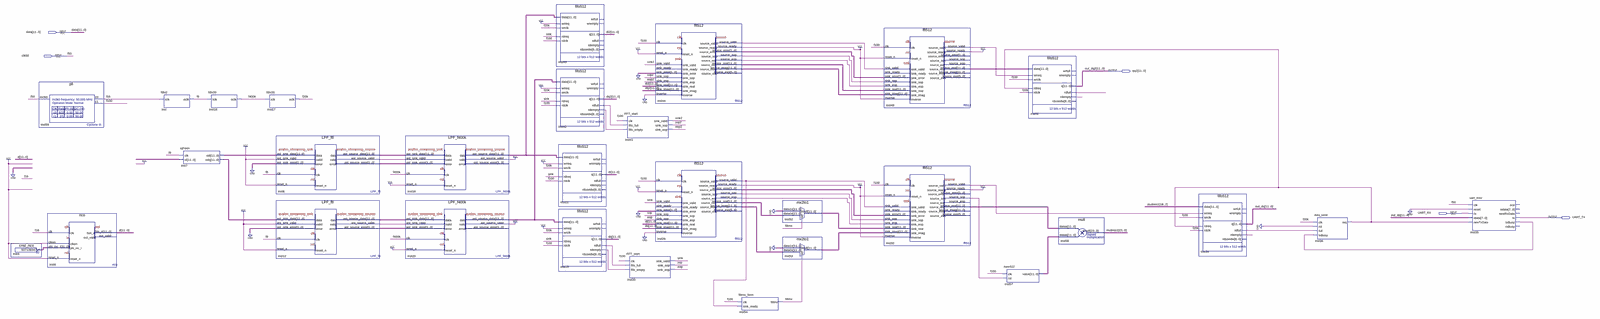
[diagram p0: schematic sheet, whole]
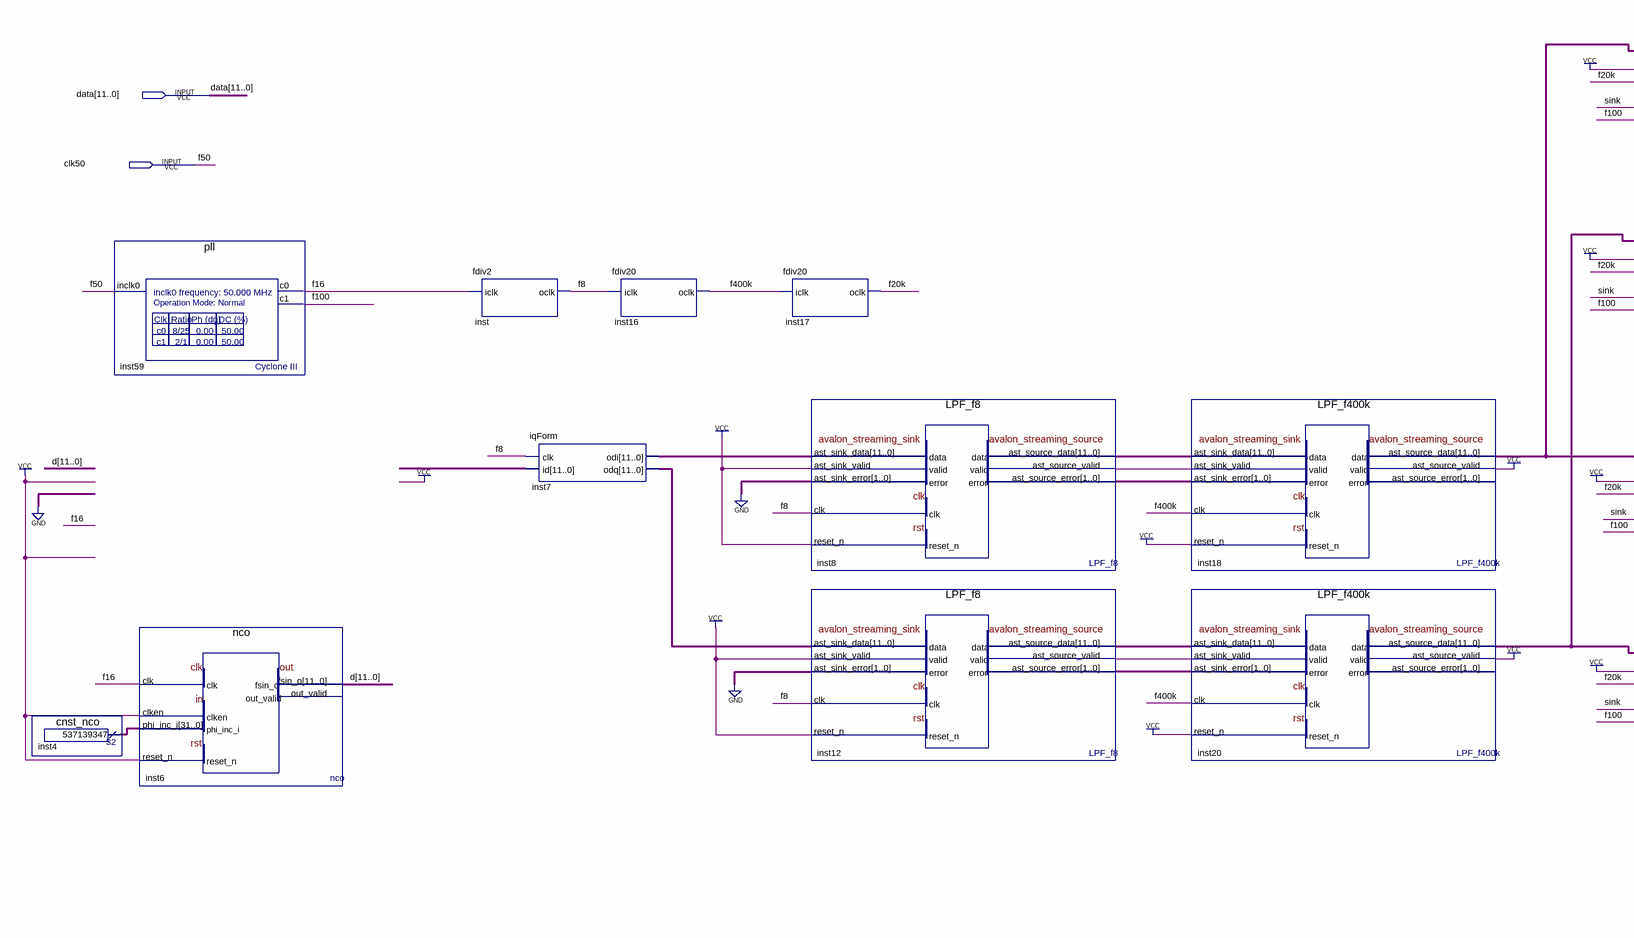
[diagram p1: schematic sheet, left part]
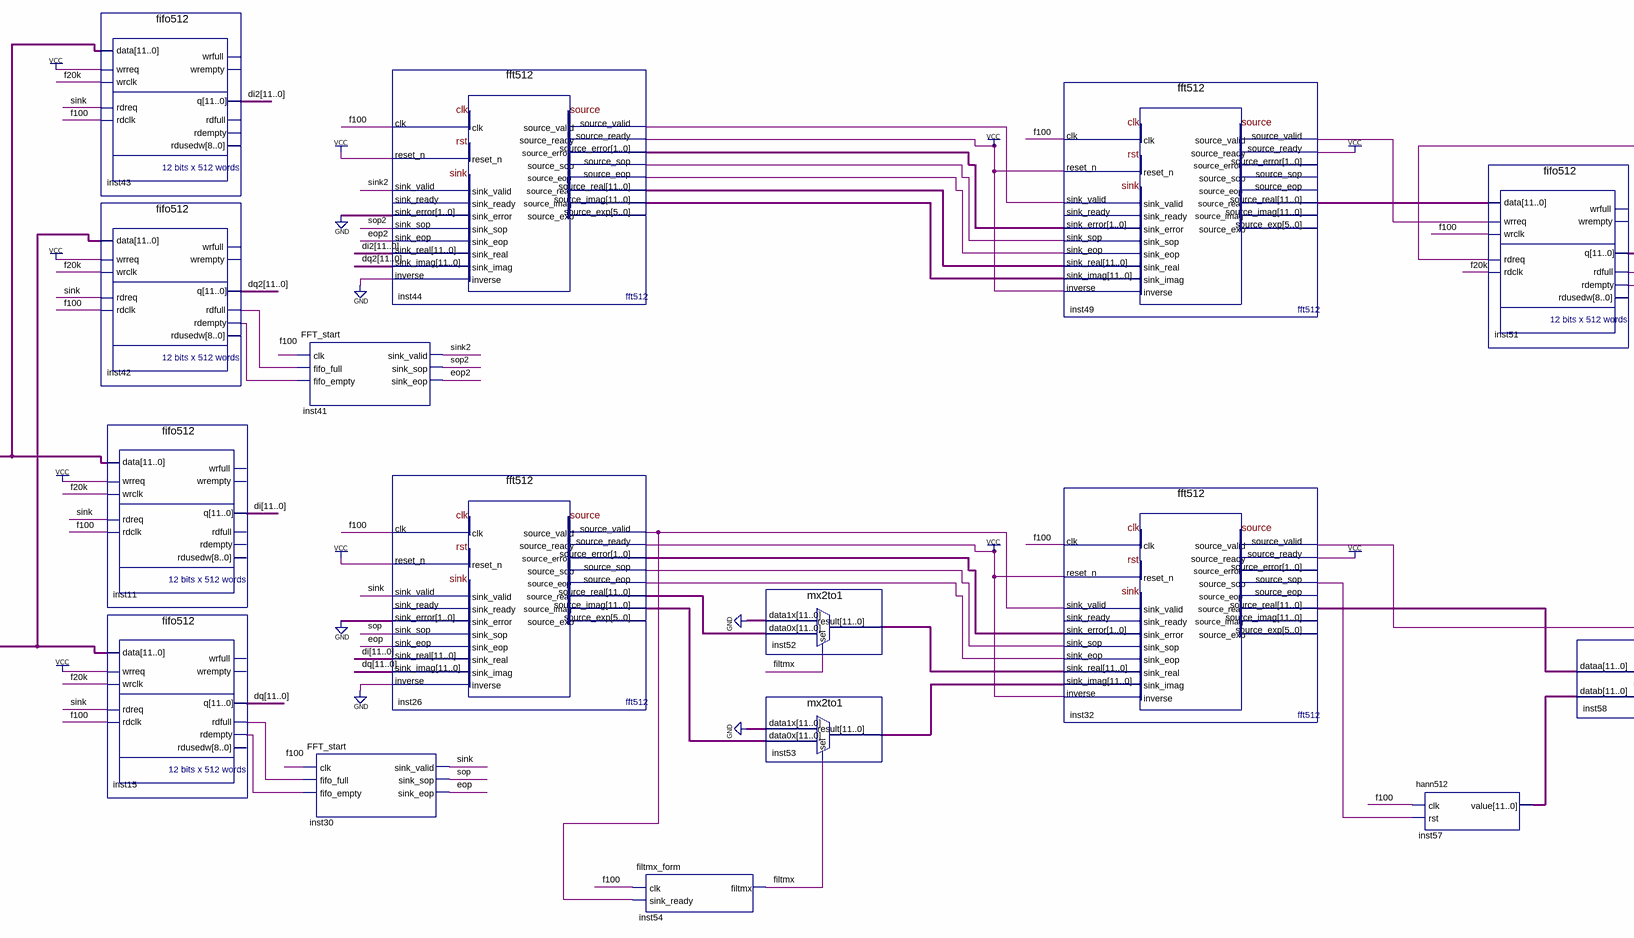
[diagram p2: schematic sheet, centre part]
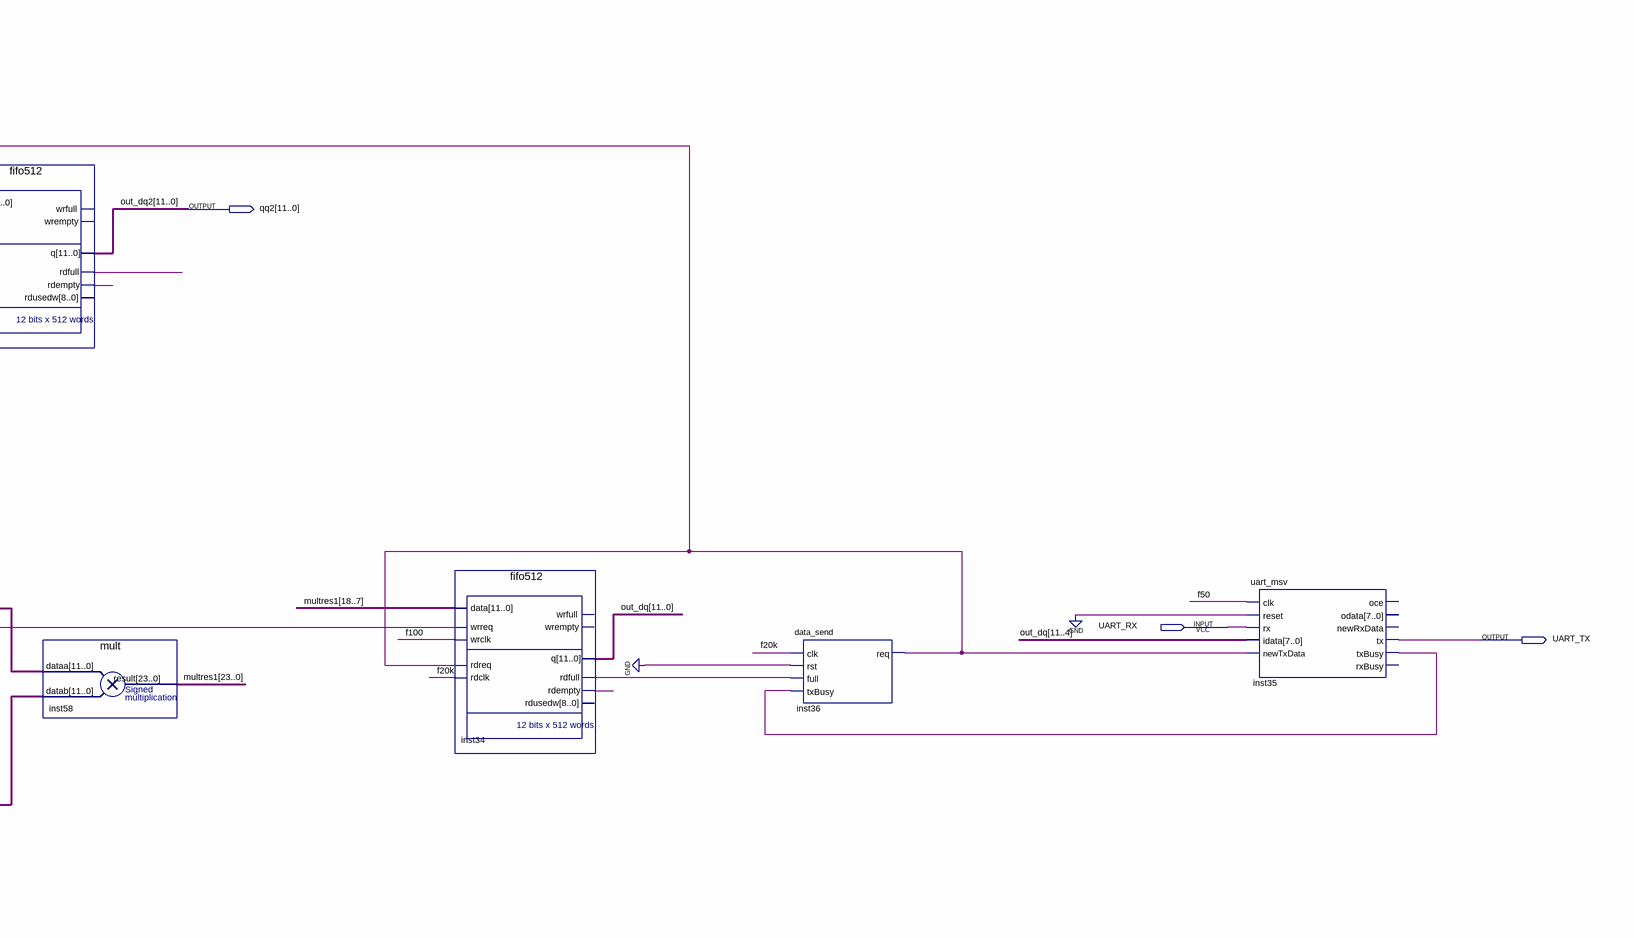
[diagram p3: schematic sheet, right part]
// Quartus schematic us_dsp.bdf as structural Verilog: 30 symbols, 5 pins
module us_dsp (
  input  [11:0] data,
  input  clk50,
  input  UART_RX,
  output [11:0] qq2,
  output UART_TX
);

  wire eop, eop2, f8, f16, f20k, f100, f400k, filtmx, inst8_ast_source_valid, inst12_ast_source_valid,
       inst15_rdempty, inst15_rdfull, inst18_ast_source_valid, inst20_ast_source_valid, inst26_source_eop,
       inst26_source_sop, inst26_source_valid, inst32_source_sop, inst32_source_valid, inst34_rdempty,
       inst34_rdfull, inst35_txbusy, inst36_req, inst42_rdempty, inst42_rdfull, inst44_source_eop,
       inst44_source_sop, inst44_source_valid, inst49_source_valid, inst51_rdempty, inst51_rdfull, sink,
       sink2, sop, sop2;
  wire [1:0] inst8_ast_source_error, inst12_ast_source_error, inst26_source_error, inst44_source_error;
  wire [11:0] d, di, di2, dq, dq2, inst7_odi, inst7_odq, inst8_ast_source_data, inst12_ast_source_data,
       inst18_ast_source_data, inst20_ast_source_data, inst26_source_imag, inst26_source_real,
       inst32_source_real, inst44_source_imag, inst44_source_real, inst49_source_real, inst52_result,
       inst53_result, inst57_value, out_dq, undriven;
  wire [23:0] multres1;
  wire [31:0] inst4_result;

  cnst_nco inst4 (.result(inst4_result));
  pll inst59 (.inclk0(clk50), .c0(f16), .c1(f100));
  nco inst6 (.clk(f16), .clken(1'b1), .phi_inc_i(inst4_result), .reset_n(1'b1), .fsin_o(d));  // open: out_valid
  fdiv2 inst (.iclk(f16), .oclk(f8));
  iqForm inst7 (.clk(f8), .id(undriven), .odi(inst7_odi), .odq(inst7_odq));
  fdiv20 inst16 (.iclk(f8), .oclk(f400k));
  fdiv20 inst17 (.iclk(f400k), .oclk(f20k));
  LPF_f8 inst8 (
    .ast_sink_data(inst7_odi), .ast_sink_valid(1'b1), .ast_sink_error(2'b00), .clk(f8), .reset_n(1'b1),
    .ast_source_data(inst8_ast_source_data), .ast_source_valid(inst8_ast_source_valid),
    .ast_source_error(inst8_ast_source_error));
  LPF_f8 inst12 (
    .ast_sink_data(inst7_odq), .ast_sink_valid(1'b1), .ast_sink_error(2'b00), .clk(f8), .reset_n(1'b1),
    .ast_source_data(inst12_ast_source_data), .ast_source_valid(inst12_ast_source_valid),
    .ast_source_error(inst12_ast_source_error));
  LPF_f400k inst18 (
    .ast_sink_data(inst8_ast_source_data), .ast_sink_valid(inst8_ast_source_valid),
    .ast_sink_error(inst8_ast_source_error), .clk(f400k), .reset_n(1'b1),
    .ast_source_data(inst18_ast_source_data), .ast_source_valid(inst18_ast_source_valid));  // open: ast_source_error
  LPF_f400k inst20 (
    .ast_sink_data(inst12_ast_source_data), .ast_sink_valid(inst12_ast_source_valid),
    .ast_sink_error(inst12_ast_source_error), .clk(f400k), .reset_n(1'b1),
    .ast_source_data(inst20_ast_source_data), .ast_source_valid(inst20_ast_source_valid));  // open: ast_source_error
  fifo512 inst43 (
    .data(inst18_ast_source_data), .wrreq(1'b1), .wrclk(f20k), .rdreq(sink), .rdclk(f100), .q(di2));  // open: wrfull, wrempty, rdfull, rdempty, rdusedw
  fifo512 inst42 (
    .data(inst20_ast_source_data), .wrreq(1'b1), .wrclk(f20k), .rdreq(sink), .rdclk(f100), .q(dq2),
    .rdfull(inst42_rdfull), .rdempty(inst42_rdempty));  // open: wrfull, wrempty, rdusedw
  fifo512 inst11 (
    .data(inst18_ast_source_data), .wrreq(1'b1), .wrclk(f20k), .rdreq(sink), .rdclk(f100), .q(di));  // open: wrfull, wrempty, rdfull, rdempty, rdusedw
  fifo512 inst15 (
    .data(inst20_ast_source_data), .wrreq(1'b1), .wrclk(f20k), .rdreq(sink), .rdclk(f100), .q(dq),
    .rdfull(inst15_rdfull), .rdempty(inst15_rdempty));  // open: wrfull, wrempty, rdusedw
  FFT_start inst41 (
    .clk(f100), .fifo_full(inst42_rdfull), .fifo_empty(inst42_rdempty), .sink_valid(sink2), .sink_sop(sop2),
    .sink_eop(eop2));
  FFT_start inst30 (
    .clk(f100), .fifo_full(inst15_rdfull), .fifo_empty(inst15_rdempty), .sink_valid(sink), .sink_sop(sop),
    .sink_eop(eop));
  fft512 inst44 (
    .clk(f100), .reset_n(1'b1), .sink_valid(sink2), .sink_error(2'b00), .sink_sop(sop2), .sink_eop(eop2),
    .sink_real(di2), .sink_imag(dq2), .inverse(1'b0), .source_ready(1'b1),
    .source_valid(inst44_source_valid), .source_error(inst44_source_error), .source_sop(inst44_source_sop),
    .source_eop(inst44_source_eop), .source_real(inst44_source_real), .source_imag(inst44_source_imag));  // open: sink_ready, source_exp
  fft512 inst26 (
    .clk(f100), .reset_n(1'b1), .sink_valid(sink), .sink_error(2'b00), .sink_sop(sop), .sink_eop(eop),
    .sink_real(di), .sink_imag(dq), .inverse(1'b0), .source_ready(1'b1), .source_valid(inst26_source_valid),
    .source_error(inst26_source_error), .source_sop(inst26_source_sop), .source_eop(inst26_source_eop),
    .source_real(inst26_source_real), .source_imag(inst26_source_imag));  // open: sink_ready, source_exp
  filtmx_form inst54 (.clk(f100), .sink_ready(inst26_source_valid), .filtmx(filtmx));
  mx2to1 inst52 (.data1x({12{1'b0}}), .data0x(inst26_source_real), .sel(filtmx), .result(inst52_result));
  mx2to1 inst53 (.data1x({12{1'b0}}), .data0x(inst26_source_imag), .sel(filtmx), .result(inst53_result));
  fft512 inst49 (
    .clk(f100), .reset_n(1'b1), .sink_valid(inst44_source_valid), .sink_error(inst44_source_error),
    .sink_sop(inst44_source_sop), .sink_eop(inst44_source_eop), .sink_real(inst44_source_real),
    .sink_imag(inst44_source_imag), .inverse(1'b1), .source_ready(1'b1), .source_valid(inst49_source_valid),
    .source_real(inst49_source_real));  // open: sink_ready, source_error, source_sop, source_eop, source_imag, source_exp
  fft512 inst32 (
    .clk(f100), .reset_n(1'b1), .sink_valid(inst26_source_valid), .sink_error(inst26_source_error),
    .sink_sop(inst26_source_sop), .sink_eop(inst26_source_eop), .sink_real(inst52_result),
    .sink_imag(inst53_result), .inverse(1'b1), .source_ready(1'b1), .source_valid(inst32_source_valid),
    .source_sop(inst32_source_sop), .source_real(inst32_source_real));  // open: sink_ready, source_error, source_eop, source_imag, source_exp
  hann512 inst57 (.clk(f100), .rst(inst32_source_sop), .value(inst57_value));
  fifo512 inst51 (
    .data(inst49_source_real), .wrreq(inst49_source_valid), .wrclk(f100), .rdreq(inst36_req), .rdclk(f20k),
    .q(qq2), .rdfull(inst51_rdfull), .rdempty(inst51_rdempty));  // open: wrfull, wrempty, rdusedw
  mult inst58 (.dataa(inst32_source_real), .datab(inst57_value), .result(multres1));
  fifo512 inst34 (
    .data(multres1[18:7]), .wrreq(inst32_source_valid), .wrclk(f100), .rdreq(inst36_req), .rdclk(f20k),
    .q(out_dq), .rdfull(inst34_rdfull), .rdempty(inst34_rdempty));  // open: wrfull, wrempty, rdusedw
  data_send inst36 (.clk(f20k), .rst(1'b0), .full(inst34_rdfull), .txBusy(inst35_txbusy), .req(inst36_req));
  uart_msv inst35 (
    .clk(clk50), .reset(1'b0), .rx(UART_RX), .idata(out_dq[11:4]), .newTxData(inst36_req), .tx(UART_TX),
    .txBusy(inst35_txbusy));  // open: oce, odata, newRxData, rxBusy
  // also tied to VCC on the sheet: {inst18_ast_source_valid, inst20_ast_source_valid}

  // Other names for the same wires on the sheet: f50 = clk50; out_dq2[11:0] = qq2
endmodule
